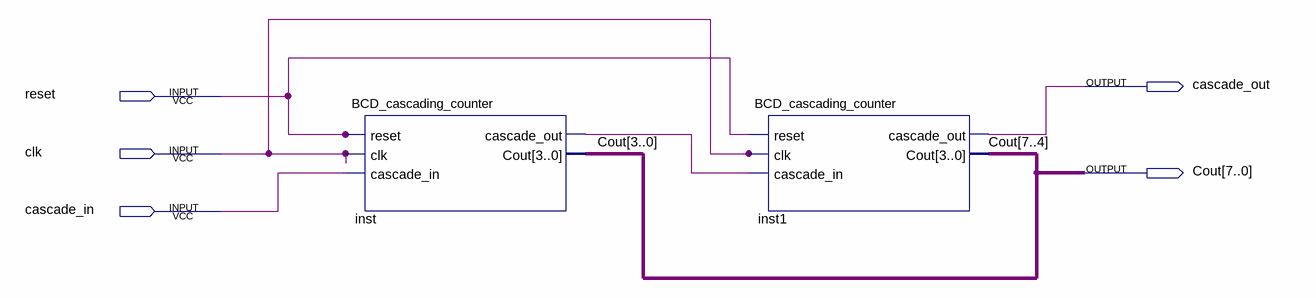
[diagram p0: schematic sheet]
// Quartus schematic BCD_cascading_counting_0_to_99.bdf as structural Verilog: 2 symbols, 5 pins
module BCD_cascading_counting_0_to_99 (
  input  reset,
  input  clk,
  input  cascade_in,
  output cascade_out,
  output [7:0] Cout
);

  wire inst_cascade_out;

  BCD_cascading_counter inst (
    .reset(reset), .clk(clk), .cascade_in(cascade_in), .cascade_out(inst_cascade_out), .Cout(Cout[3:0]));
  BCD_cascading_counter inst1 (
    .reset(reset), .clk(clk), .cascade_in(inst_cascade_out), .cascade_out(cascade_out), .Cout(Cout[7:4]));
endmodule
